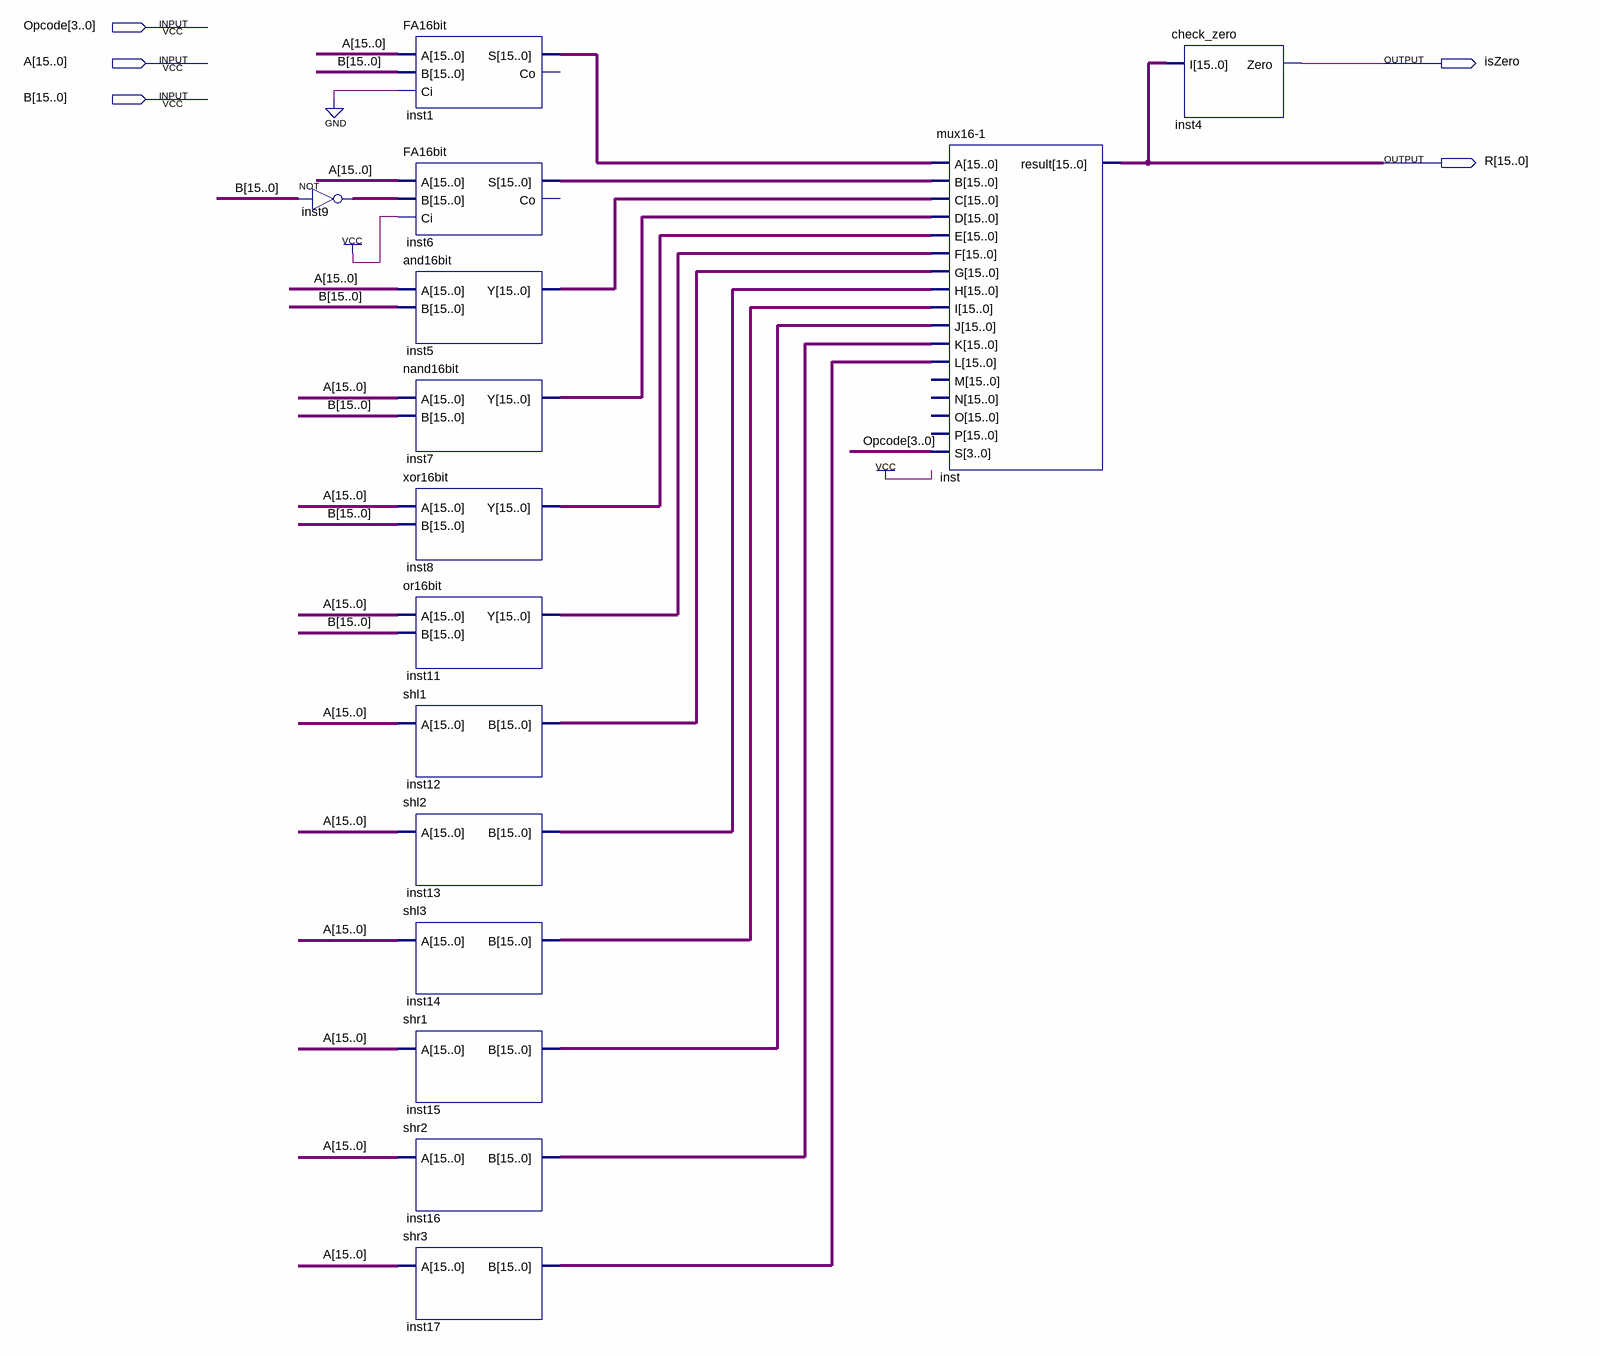
[diagram p0: schematic sheet]
// Quartus schematic alu.bdf as structural Verilog: 15 symbols, 5 pins
module alu (
  input  [3:0] Opcode,
  input  [15:0] A,
  input  [15:0] B,
  output isZero,
  output [15:0] R
);

  wire [15:0] inst1_s, inst5_y, inst6_s, inst7_y, inst8_y, inst9_out, inst11_y, inst12_b, inst13_b, inst14_b,
       inst15_b, inst16_b, inst17_b;

  assign inst9_out = ~B;  // NOT inst9, 16 bits wide
  FA16bit inst1 (.A(A), .B(B), .Ci(1'b0), .S(inst1_s));  // open: Co
  FA16bit inst6 (.A(A), .B(inst9_out), .Ci(1'b1), .S(inst6_s));  // open: Co
  and16bit inst5 (.A(A), .B(B), .Y(inst5_y));
  nand16bit inst7 (.A(A), .B(B), .Y(inst7_y));
  xor16bit inst8 (.A(A), .B(B), .Y(inst8_y));
  or16bit inst11 (.A(A), .B(B), .Y(inst11_y));
  shl1 inst12 (.A(A), .B(inst12_b));
  shl2 inst13 (.A(A), .B(inst13_b));
  shl3 inst14 (.A(A), .B(inst14_b));
  shr1 inst15 (.A(A), .B(inst15_b));
  shr2 inst16 (.A(A), .B(inst16_b));
  shr3 inst17 (.A(A), .B(inst17_b));
  \mux16-1  inst (
    .A(inst1_s), .B(inst6_s), .C(inst5_y), .D(inst7_y), .E(inst8_y), .F(inst11_y), .G(inst12_b),
    .H(inst13_b), .I(inst14_b), .J(inst15_b), .K(inst16_b), .L(inst17_b), .S(Opcode), .result(R));  // open: M, N, O, P
  check_zero inst4 (.I(R), .Zero(isZero));
endmodule
